# EAGLE design attiny84breakout (EAGLE 7.4.0)
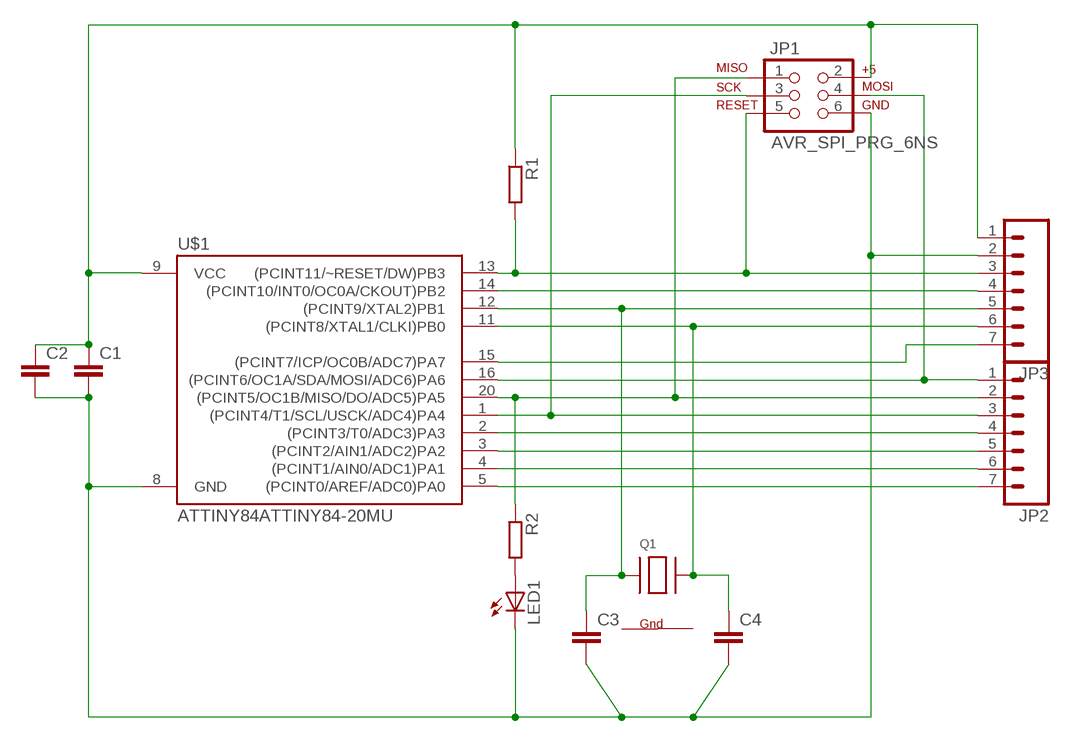
[diagram p0: schematic, sheet 1]

## Parts
C1  C-EUC0402  [C0402]
C2  C-EUC0402  [C0402]
C3  C-EUC0402  [C0402]
C4  C-EUC0402  [C0402]
JP1  AVR_SPI_PRG_6NS  [2X3-NS]
JP2  M07  [1X07]
JP3  M07  [1X07]
LED1  LEDCHIP-LED0805  [CHIP-LED0805]
Q1  XTAL-4-3225  [NX3225]
R1  R-EU_R0603  [R0603]
R2  R-EU_R0603  [R0603]
U$1  ATTINY84ATTINY84-20MU  [QFN20]

## Nets
GND: C1.2 C2.2 C3.2 C4.2 JP1.6 JP3.2 LED1.C U$1.8(GND)
N$1: JP2.7 U$1.5((PCINT0/AREF/ADC0)PA0)
N$2: JP2.6 U$1.4((PCINT1/AIN0/ADC1)PA1)
N$3: JP1.5 JP3.3 R1.2 U$1.13((PCINT11/~RESET/DW)PB3)
N$4: JP1.3 JP2.3 U$1.1((PCINT4/T1/SCL/USCK/ADC4)PA4)
N$5: JP1.4 JP2.1 U$1.16((PCINT6/OC1A/SDA/MOSI/ADC6)PA6)
N$6: JP1.1 JP2.2 R2.1 U$1.20((PCINT5/OC1B/MISO/DO/ADC5)PA5)
N$7: C1.1 C2.1 JP1.2 JP3.1 R1.1 U$1.9(VCC)
N$8: LED1.A R2.2
N$9: JP2.5 U$1.3((PCINT2/AIN1/ADC2)PA2)
N$10: JP2.4 U$1.2((PCINT3/T0/ADC3)PA3)
N$11: JP3.7 U$1.15((PCINT7/ICP/OC0B/ADC7)PA7)
N$13: C3.1 JP3.5 Q1.1(X1) U$1.12((PCINT9/XTAL2)PB1)
N$14: JP3.4 U$1.14((PCINT10/INT0/OC0A/CKOUT)PB2)
N$17: C4.1 JP3.6 Q1.3(X2) U$1.11((PCINT8/XTAL1/CLKI)PB0)

## Power pins joined to a net without a drawn wire
G1: Q1.4(G1)
G2: Q1.2(G2)

## Library data of the parts
C1-C4 = rcl:C-EU: CAPACITOR, European symbol
JP1 = SparkFun-Connectors:AVR_SPI_PRG_6: AVR ISP 6 Pin This is the reduced ISP connector for AVR programming. Common on Arduino. This footprint will take up less PCB space and can be used with a 10-pin to 6-pin adapter such as SKU: BOB-08508 **Special note about "TEST_POINT" package. The stop mask is on the top side, so if you want your programming test points to be on the bottom of your board, make sure to place this package on the bottom side of the board. This also ensure that the orientation to program from the bottom side will be correct.
JP2 JP3 = SparkFun-Connectors:M07: Header 7 Standard 7-pin 0.1" header. Use with straight break away headers (SKU : PRT-00116), right angle break away headers (PRT-00553), swiss pins (PRT-00743), machine pins (PRT-00117), and female headers (PRT-00115). NOTES ON THE VARIANTS LOCK and LOCK_LONGPADS... This footprint was designed to help hold the alignment of a through-hole component (i.e. 7-pin header) while soldering it into place. You may notice that each hole has been shifted either up or down by 0.005 of an inch from it's more standard position (which is usually a perfectly straight line). This slight alteration caused the pins (the squares in the middle) to touch the edges of the holes. Because they are alternating, it causes a "brace" to hold the header in place. 0.005 has proven to be the perfect amount of "off-center" position when using our standard breakaway headers. Although looks a little odd when you look at the bare footprint, once you have a header in there, the alteration is very hard to notice. Also, if you push a header all the way into place, it is covered up entirely on the bottom side. This idea of altering the position of holes to aid alignment will be further integrated into the Sparkfun Library for other footprints. It can help hold any component with 3 or more connection pins.
LED1 = adafruit:LED: LED OSRAM: - CHIPLED LG R971, LG N971, LY N971, LG Q971, LY Q971, LO R971, LY R971 LH N974, LH R974 LS Q976, LO Q976, LY Q976 LO Q996 - Hyper CHIPLED LW Q18S LB Q993, LB Q99A, LB R99A - SideLED LS A670, LO A670, LY A670, LG A670, LP A670 LB A673, LV A673, LT A673, LW A673 LH A674 LY A675 LS A676, LA A676, LO A676, LY A676, LW A676 LS A679, LY A679, LG A679 - Hyper Micro SIDELED® LS Y876, LA Y876, LO Y876, LY Y876 LT Y87S - SmartLED LW L88C, LW L88S LB L89C, LB L89S, LG L890 LS L89K, LO L89K, LY L89K LS L896, LA L896, LO L896, LY L896 - TOPLED LS T670, LO T670, LY T670, LG T670, LP T670 LSG T670, LSP T670, LSY T670, LOP T670, LYG T670 LG T671, LOG T671, LSG T671 LB T673, LV T673, LT T673, LW T673 LH T674 LS T676, LA T676, LO T676, LY T676, LB T676, LH T676, LSB T676, LW T676 LB T67C, LV T67C, LT T67C, LS T67K, LO T67K, LY T67K, LW E67C LS E67B, LA E67B, LO E67B, LY E67B, LB E67C, LV E67C, LT E67C LW T67C LS T679, LY T679, LG T679 LS T770, LO T770, LY T770, LG T770, LP T770 LB T773, LV T773, LT T773, LW T773 LH T774 LS E675, LA E675, LY E675, LS T675 LS T776, LA T776, LO T776, LY T776, LB T776 LHGB T686 LT T68C, LB T68C - Hyper Mini TOPLED® LB M676 - Mini TOPLED Santana® LG M470 LS M47K, LO M47K, LY M47K Source: http://www.osram.convergy.de/
Q1 = adafruit:XTAL-4: Classic 4-pin 3.2 x 2.5mm crystal
R1 R2 = rcl:R-EU_: RESISTOR, European symbol
U$1 = SparkFun-DigitalIC:ATTINY84: Atmel 14-pin 2/4/8kB flash uC

## Board
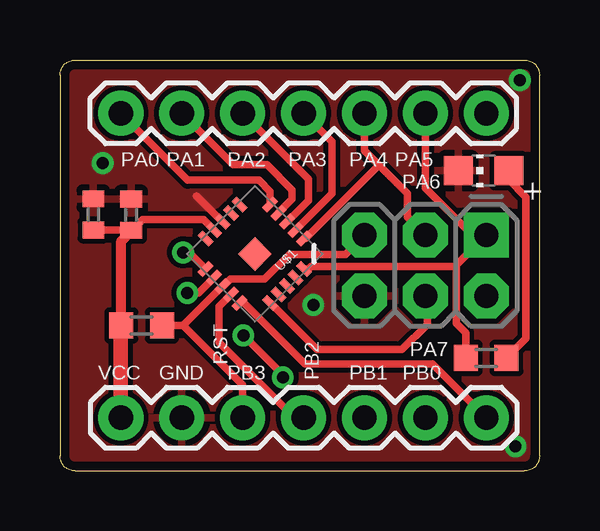
[diagram p1: board, top side]
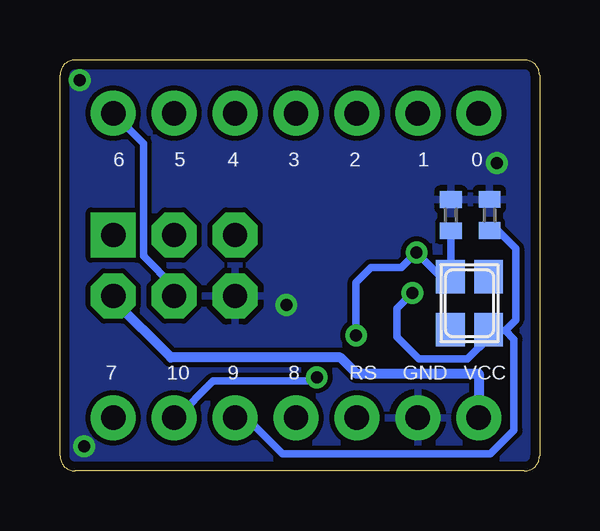
[diagram p2: board, bottom side, seen from below]

Size 20 x 17.14 mm. Coordinates in mm from the lower left corner, seen from the top.
Outline: 0.64,0 19.37,0 arc90 20,0.64 20,16.51 arc90 19.37,17.14 0.64,17.14 arc90 0,16.51 0,0.64 arc90 0.64,0
Copper layers (1*16): Top 0.035mm / dielectric 1.5mm / Bottom 0.035mm
Design rules "default *": minimum track width 10mil, minimum drill 24mil, track to track 8mil, track to pad 8mil, pad to pad 8mil, via to via 8mil, smd to smd 8mil, copper to edge 15mil, drill to drill 8mil, minimum pad ring 10mil, minimum via ring 8mil, stop-mask expansion 4mil, vias tented up to drill 20mil, thermal gap 10mil

### Footprints (pad centres in the part's own frame; a part is rotated, then mirrored left to right if it is on the bottom)
C0402 = smd 0.7 x 0.9: 1 -0.65,0; 2 0.65,0
2X3-NS = drill 1.016 pad 1.88 square: 1 -2.54,-1.27 | drill 1.016 pad 1.88 octagon: 2 -2.54,1.27; 3 0,-1.27; 4 0,1.27; 5 2.54,-1.27; 6 2.54,1.27
1X07 = drill 1.016 pad 1.88: 1 0,0; 2 2.54,0; 3 5.08,0; 4 7.62,0; 5 10.16,0; 6 12.7,0; 7 15.24,0
CHIP-LED0805 = smd 1.2 x 1.2: A 0,-1.05; C 0,1.05
NX3225 = smd 1.4 x 1.2: 1 -1.1,-0.8; 2 1.1,-0.8; 3 1.1,0.8; 4 -1.1,0.8
R0603 = smd 1 x 1.1: 1 -0.85,0; 2 0.85,0
QFN20 = smd 1 x 1: 0 0,0 | smd 0.65 x 0.3: 1 -1.9,1; 2 -1.9,0.5; 3 -1.9,0; 4 -1.9,-0.5; 5 -1.9,-1; 11 1.9,-1; 12 1.9,-0.5; 13 1.9,0; 14 1.9,0.5; 15 1.9,1 | smd 0.3 x 0.65: 6 -1,-1.9; 7 -0.5,-1.9; 8 0,-1.9; 9 0.5,-1.9; 10 1,-1.9; 16 1,1.9; 17 0.5,1.9; 18 0,1.9; 19 -0.5,1.9; 20 -1,1.9

### Placement (x,y rotation side)
C1  1.39,10.7 90 top
C2  2.97,10.69 90 top
C3  2.09,10.68 90 bottom
C4  3.7,10.67 90 bottom
JP1  15.24,8.57 180 top
JP2  17.78,14.92 180 top
JP3  2.54,2.22 0 top
LED1  17.66,12.53 90 top
Q1  2.92,7 90 bottom
R1  3.4,6.07 0 top
R2  17.77,4.72 0 top
U$1  8.12,9.06 225 top

### Tracks (layer width: path | path; a pad name or v marks a point on that pad's centre or on a via)
GND  (via drill 0.5)
  Top 0.305: U$1.8 5.7,11.47
  other vias: 1.78,12.84 10.56,6.93 19.18,16.31 19,1.03
  pour Bottom: -2.54,18.71 -2.54,-1.57 22.86,-1.57 22.86,18.71
  pour Top: -5.08,20 -5.08,-2.86 25.4,-2.86 25.4,20
N$1
  Top 0.305: U$1.5 8.76,11.66 8.3,12.13 5.33,12.13 JP2.7
N$2
  Top 0.305: U$1.4 9.12,10.77 9.68,11.34 9.68,11.72 8.63,12.77 7.23,12.77 JP2.6
N$3
  Top 0.305: R1.2 5.14,6.07 | 5.14,6.07 U$1.13 6.82,7.71 7.12,8.02 8.54,8.02 9.56,9.04 11.9,9.04 JP1.5 | JP3.3 7.62,3.59 5.14,6.07
N$4
  Top 0.305: JP2.3 12.7,13.37 13.3,12.77 | 13.3,12.77 14.49,11.58 14.49,10.59 JP1.3 | U$1.1 10.23,9.69 13.3,12.77
N$5
  Top 0.305: U$1.16 8.77,7.01 10.71,5.07 14.27,5.07 15.32,6.12 15.32,7.22 JP1.4
  Bottom 0.305: JP1.4 15.24,7.68 16.52,8.96 16.52,13.66 JP2.1
N$6
  Top 0.305: JP2.2 15.24,11.8 17.1,9.95 17.68,9.95 JP1.1 16.47,8.53 | U$1.20 10.36,8.42 10.47,8.53 16.47,8.53 | R2.1 16.92,5.76 16.52,6.16 16.52,8.48 16.47,8.53
N$7
  Top 0.305: U$1.9 5.99,10.49 3.44,10.49 C2.1 2.93,10.05 C1.1
  Top 0.406: R1.1 2.56,9.6 C2.1
  Top 0.61: JP3.1 2.54,6.06 R1.1
  Bottom 0.406: JP1.2 17.78,7.14 15.38,4.74 8.31,4.74 7.64,4.07 2.56,4.07 2.54,4.05 JP3.1
N$8
  Top 0.305: LED1.A 18.71,12.15 19.43,11.44 19.43,5.53 R2.2
N$9
  Top 0.305: U$1.3 10.36,11.28 10.36,12.18 JP2.5
N$10
  Top 0.305: U$1.2 9.82,10.06 11.34,11.58 11.34,13.74 JP2.4
N$11
  Top 0.305: U$1.15 7.68,7.01 8.94,5.75 10.21,4.48 15.53,4.48 JP3.7 17.68,2.32
N$13  (via drill 0.5)
  Top 0.305: v5.31,7.43 5.79,7.43 U$1.12
  Bottom 0.305: v5.31,7.43 5.96,6.78 5.96,5.6 5.03,4.68 3,4.68 2.12,5.56 Q1.1 2.09,5.86 1.44,5.86 | C3.1 1.74,10.03 1,9.29 1,6.3 1.44,5.86 | JP3.5 12.22,2.22 10.71,0.72 2.05,0.72 1.07,1.69 1.07,5.49 1.44,5.86
N$14
  Top 0.305: JP3.4 9.79,2.22 6.64,5.37 6.64,6.87 U$1.14
N$17  (via drill 0.5)
  Top 0.305: v9.29,3.91 9.29,4.02 v7.65,5.66 | v5.13,9.12 5.38,9.12 U$1.11
  Bottom 0.305: C4.1 3.7,8.12 Q1.3 4.11,8.1 v5.13,9.12 5.76,8.49 7.04,8.49 7.65,7.87 v7.65,5.66 | JP3.6 15.14,2.22 13.61,3.75 9.45,3.75 v9.29,3.91

### Text on the board
tPlace: PA0 | PA1 | PA2 | PA3 | PA4 | PA5 | PA6 | PA7 | RST | VCC | GND | PB3 | PB2 | PB1 | PB0
bPlace: 0 | 1 | 2 | 3 | 4 | 5 | 6 | VCC | GND | RS | 8 | 9 | 10 | 7